# EAGLE schematic STM8_IoT_Board (EAGLE 7.4.0)
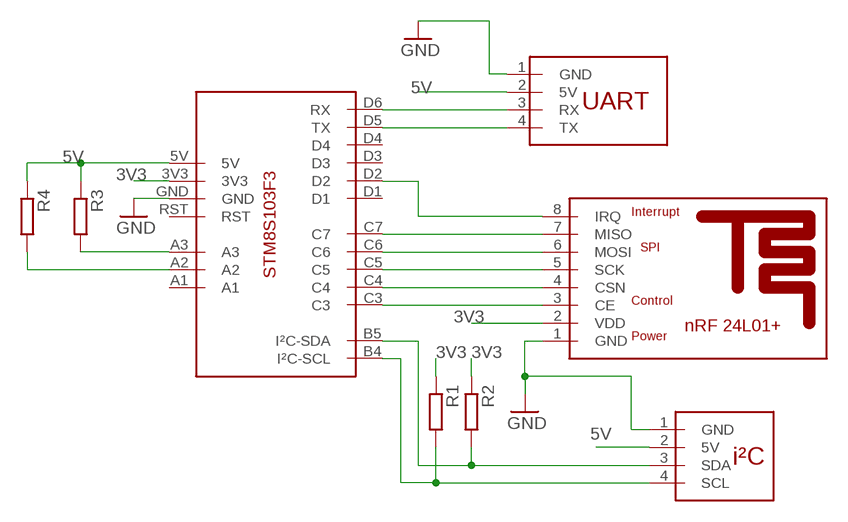
[diagram p0: schematic, sheet 1]

## Parts
R1  1k  R-EU_R1206  [R1206]
R2  1k  R-EU_R1206  [R1206]
R3  1k  R-EU_R1206  [R1206]
R4  1k  R-EU_R1206  [R1206]
U$1  STM8S103F3-DEVKITMINI  [STM8S103F3-DEVKIT-MINI]
U$2  NRF24L01+REFDESIGNMINI  [NRF24L01+REFDESIGN-MINI]
U$3  UARTMINI  [UART-MINI]
U$4  I2CMINI  [I2C-MINI]

## Nets
3V3: R1.1 R2.1 U$1.3V3 U$2.2(VDD)
5V: R3.1 R4.1 U$1.5V U$3.2(5V) U$4.2(5V)
GND: U$1.GND U$2.1(GND) U$3.1(GND) U$4.1(GND)
N$1: U$1.D5(TX) U$3.4(TX)
N$2: U$1.C3 U$2.3(CE)
N$3: U$1.C4 U$2.4(CSN)
N$4: U$1.C5 U$2.5(SCK)
N$5: U$1.C6 U$2.6(MOSI)
N$6: U$1.C7 U$2.7(MISO)
N$7: R2.2 U$1.B5(I²C-SDA) U$4.3(SDA)
N$8: U$1.D2 U$2.8(IRQ)
N$9: U$1.D6(RX) U$3.3(RX)
N$10: R3.2 U$1.A3
N$11: R1.2 U$1.B4(I²C-SCL) U$4.4(SCL)
N$12: R4.2 U$1.A2
Unconnected: U$1.A1 U$1.D1 U$1.D3 U$1.D4 U$1.RST

## Library data of the parts
R1-R4 = resistor:R-EU_: RESISTOR, European symbol
U$1 = STM8DevKit:STM8S103F3-DEVKIT: Development kit of the STM8S103F3 with a Test Led, power Led and reset button
U$2 = nRF24L01+RefDesign:NRF24L01+REFDESIGN
U$3 = WFConnectors:UART
U$4 = WFConnectors:I2C

## Net classes
0 default: width 0.305 mm, drill 0.508 mm, clearance 0.254 mm